# EAGLE design doomba_cape (EAGLE 7.1.0)
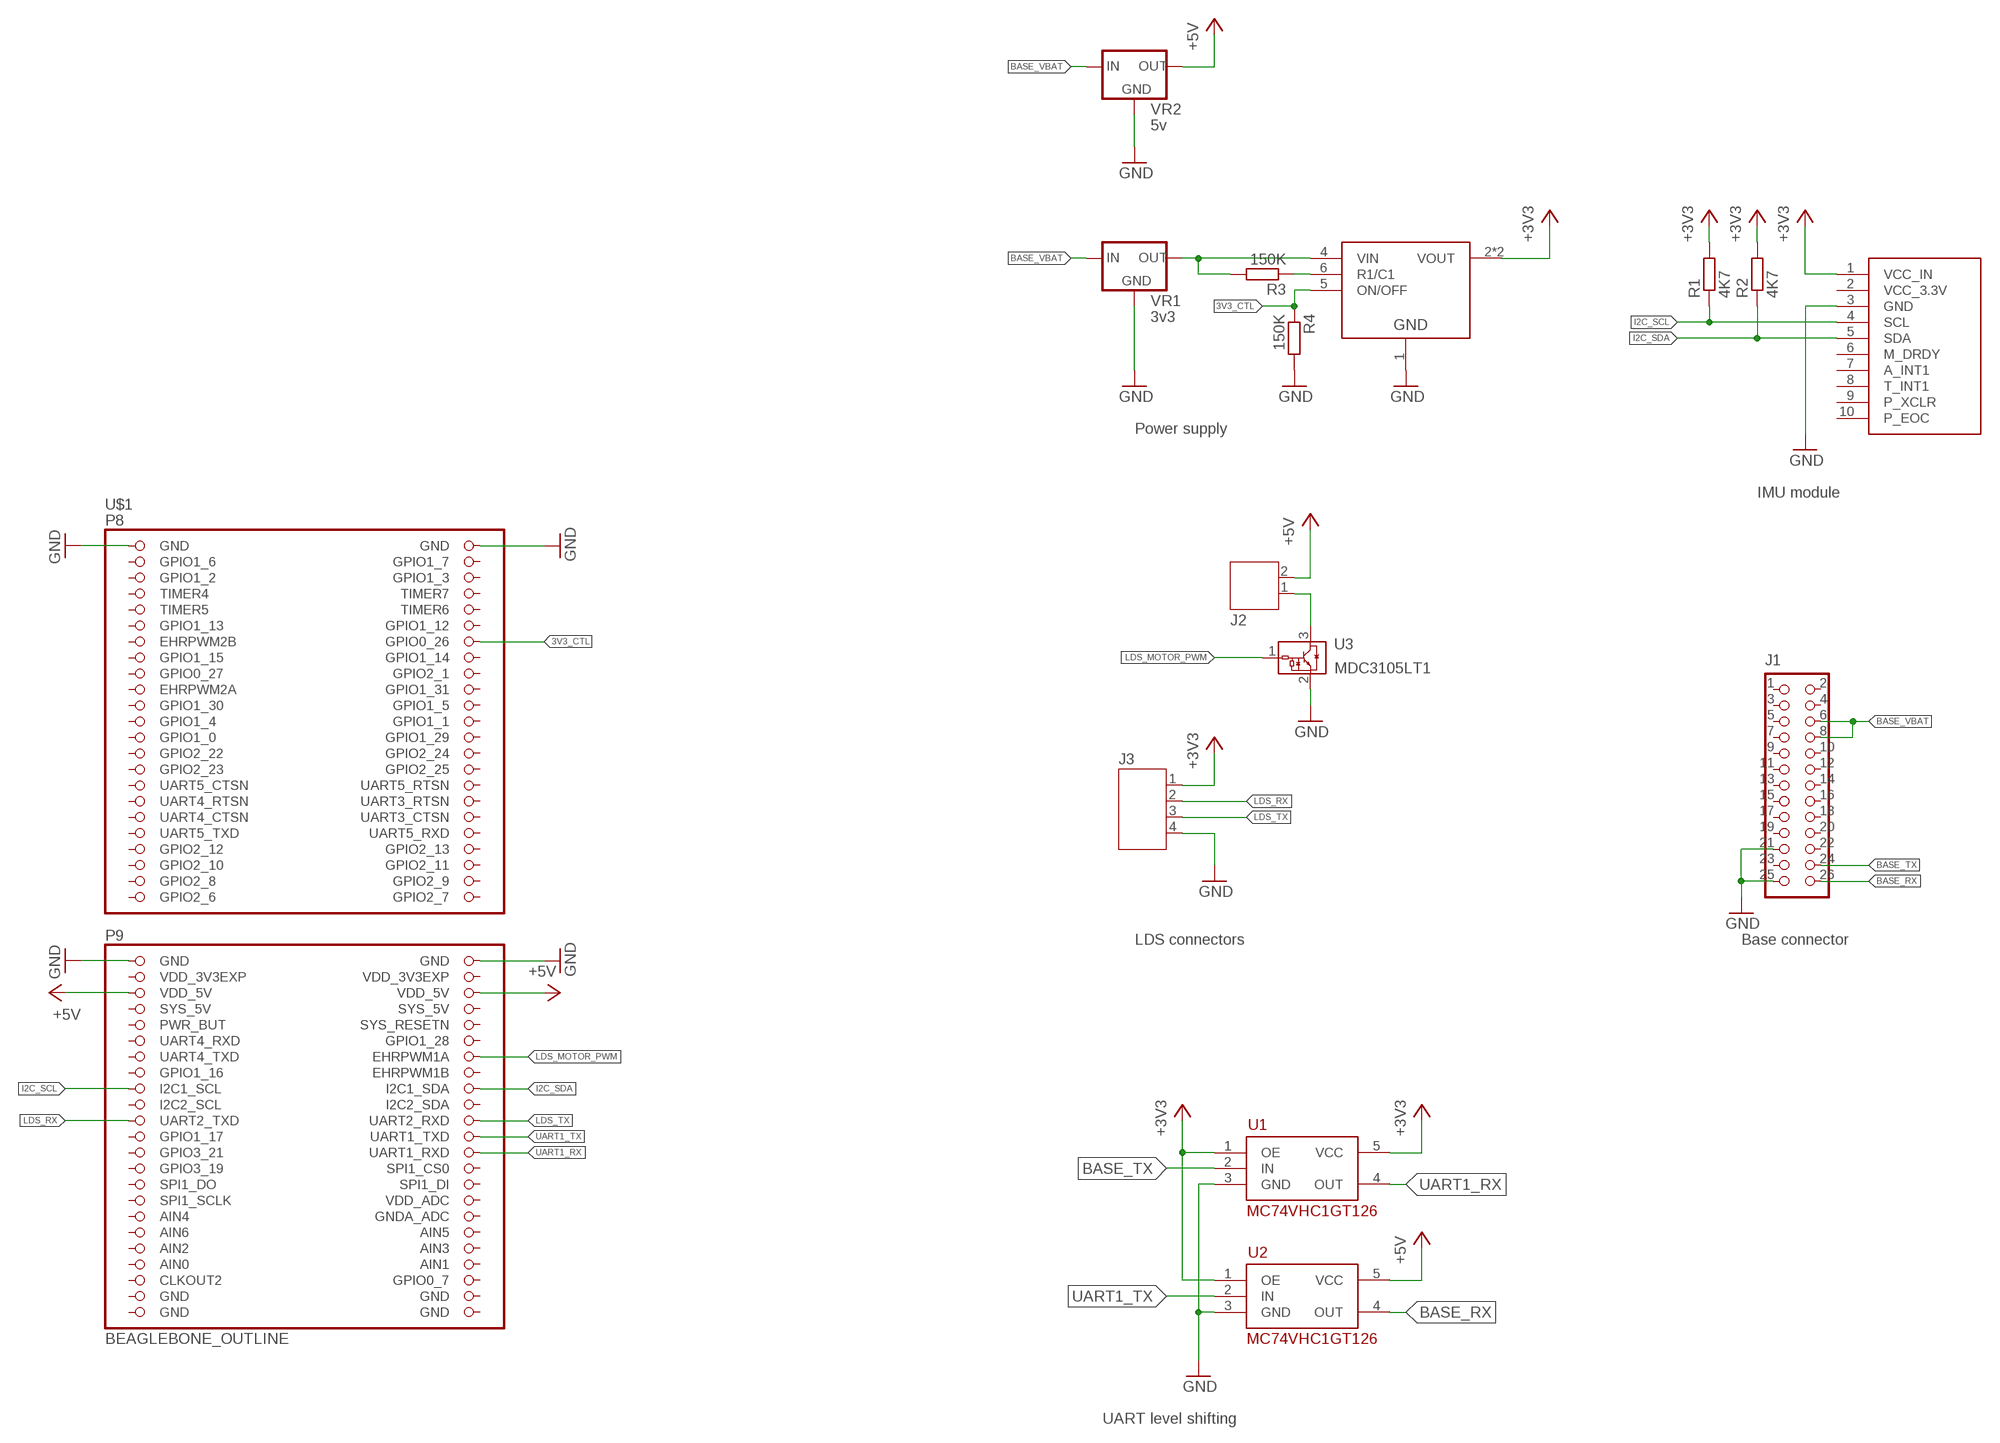
[diagram p0: schematic, sheet 1]

## Parts
J1  CONN_SHROUD_13X2  [SHROUD_13X2]
J2  JST-PH2  [JST-PH2]
J3  JST-PH4  [JST-PH4]
R1  4K7  R-EU_R0603  [R0603]
R2  4K7  R-EU_R0603  [R0603]
R3  150K  R-EU_R0603  [R0603]
R4  150K  R-EU_R0603  [R0603]
U1  MC74VHC1GT126  [SOT-353]
U2  MC74VHC1GT126  [SOT-353]
U3  MDC3105LT1  [SOT23]
U$1  BEAGLEBONE_OUTLINE  [BEAGLEBONE_SHIELD]
U$3  IMU-MODULE  [IMU_MODULE]
U$4  TPS27082L  [DDC]
VR1  3v3  MUR_OKI-78_90DEG  [2X3_90DEG]
VR2  5v  MUR_OKI-78_90DEG  [2X3_90DEG]

## Nets
3V3_CTL: R4.1 U$1.14(GPIO0_26) U$4.5(ON/OFF)
+3V3: J3.1 R1.2 R2.2 U1.1(OE) U1.5(VCC) U2.1(OE) U$3.1(VCC_IN) U$4.2(VOUT) U$4.3(VOUT)
+5V: J2.2 U2.5(VCC) U$1.51(VDD_5V) U$1.52(VDD_5V) VR2.1(OUT)
BASE_RX: J1.26 U2.4(OUT)
BASE_TX: J1.24 U1.2(IN)
BASE_VBAT: J1.6 J1.8 VR1.3(IN) VR2.3(IN)
GND: J1.21 J1.25 J3.4 R4.2 U1.3(GND) U2.3(GND) U3.2(GND) U$1.1(GND) U$1.2(GND) U$1.47(GND) U$1.48(GND) U$3.3(GND) U$4.1(GND) VR1.2(GND) VR2.2(GND)
I2C_SCL: R1.1 U$1.63(I2C1_SCL) U$3.4(SCL)
I2C_SDA: R2.1 U$1.64(I2C1_SDA) U$3.5(SDA)
LDS_MOTOR_PWM: U3.1(VIN) U$1.60(EHRPWM1A)
LDS_RX: J3.2 U$1.67(UART2_TXD)
LDS_TX: J3.3 U$1.68(UART2_RXD)
N$1: R3.2 U$4.4(VIN) VR1.1(OUT)
N$2: R3.1 U$4.6(R1/C1)
N$3: J2.1 U3.3(VOUT)
UART1_RX: U1.4(OUT) U$1.72(UART1_RXD)
UART1_TX: U2.2(IN) U$1.70(UART1_TXD)
Unconnected: J1.1 J1.2 J1.3 J1.4 J1.5 J1.7 J1.9 J1.10 J1.11 J1.12 J1.13 J1.14 J1.15 J1.16 J1.17 J1.18 J1.19 J1.20 J1.22 J1.23 U$1.3(GPIO1_6) U$1.4(GPIO1_7) U$1.5(GPIO1_2) U$1.6(GPIO1_3) U$1.7(TIMER4) U$1.8(TIMER7) U$1.9(TIMER5) U$1.10(TIMER6) U$1.11(GPIO1_13) U$1.12(GPIO1_12) U$1.13(EHRPWM2B) U$1.15(GPIO1_15) U$1.16(GPIO1_14) U$1.17(GPIO0_27) U$1.18(GPIO2_1) U$1.19(EHRPWM2A) U$1.20(GPIO1_31) U$1.21(GPIO1_30) U$1.22(GPIO1_5) U$1.23(GPIO1_4) U$1.24(GPIO1_1) U$1.25(GPIO1_0) U$1.26(GPIO1_29) U$1.27(GPIO2_22) U$1.28(GPIO2_24) U$1.29(GPIO2_23) U$1.30(GPIO2_25) U$1.31(UART5_CTSN) U$1.32(UART5_RTSN) U$1.33(UART4_RTSN) U$1.34(UART3_RTSN) U$1.35(UART4_CTSN) U$1.36(UART3_CTSN) U$1.37(UART5_TXD) U$1.38(UART5_RXD) U$1.39(GPIO2_12) U$1.40(GPIO2_13) U$1.41(GPIO2_10) U$1.42(GPIO2_11) U$1.43(GPIO2_8) U$1.44(GPIO2_9) U$1.45(GPIO2_6) U$1.46(GPIO2_7) U$1.54(SYS_5V) U$1.55(PWR_BUT) U$1.56(SYS_RESETN) U$1.57(UART4_RXD) U$1.58(GPIO1_28) U$1.59(UART4_TXD) U$1.61(GPIO1_16) U$1.62(EHRPWM1B) U$1.65(I2C2_SCL) U$1.66(I2C2_SDA) U$1.69(GPIO1_17) U$1.71(GPIO3_21) U$1.73(GPIO3_19) U$1.74(SPI1_CS0) U$1.75(SPI1_DO) U$1.76(SPI1_DI) U$1.77(SPI1_SCLK) U$1.78(VDD_ADC) U$1.79(AIN4) U$1.80(GNDA_ADC) U$1.81(AIN6) U$1.82(AIN5) U$1.83(AIN2) U$1.84(AIN3) U$1.86(AIN1) U$1.87(CLKOUT2) U$1.88(GPIO0_7) U$3.2(VCC_3.3V) U$3.6(M_DRDY) U$3.7(A_INT1) U$3.8(T_INT1) U$3.9(P_XCLR) U$3.10(P_EOC)

## Notes on the sheet
- Power supply
- IMU module
- LDS connectors | Base connector
- UART level shifting

## Power pins joined to a net without a drawn wire
AIN0: U$1.85(AIN0)
GND: U$1.89(GND) U$1.90(GND) U$1.91(GND) U$1.92(GND)
SYS_5V: U$1.53(SYS_5V)
VDD_3V3EXP: U$1.49(VDD_3V3EXP) U$1.50(VDD_3V3EXP)

## Library data of the parts
J1 = parts:CONN_SHROUD_13X2
J2 = jst-ph:JST-PH2
J3 = jst-ph:JST-PH4
R1-R4 = resistor:R-EU_: RESISTOR, European symbol
U1 U2 = parts:MC74VHC1GT126
U3 = on-semiconductor:MDC3105LT1: Integrated Relay, Inductive Load Driver Sopurce: U6 OnSemi Inductive Load Driver MDC3105-D.PDF; MF: ON SEMICONDUCTOR; MPN: MDC3105LT1; OC_FARNELL: 1126459; OC_NEWARK: 16F6132
U$1 = adafruit:BEAGLEBONE_OUTLINE: Should match A3 pinout - but not completely tested
U$3 = parts:IMU-MODULE
U$4 = parts:TPS27082L: 1.2-8V, 3A PFET load switch
VR1 VR2 = parts:MUR_OKI-78_90DEG: Murata OKI-78 Buck Module mounted in a 90-deg socket

## Board
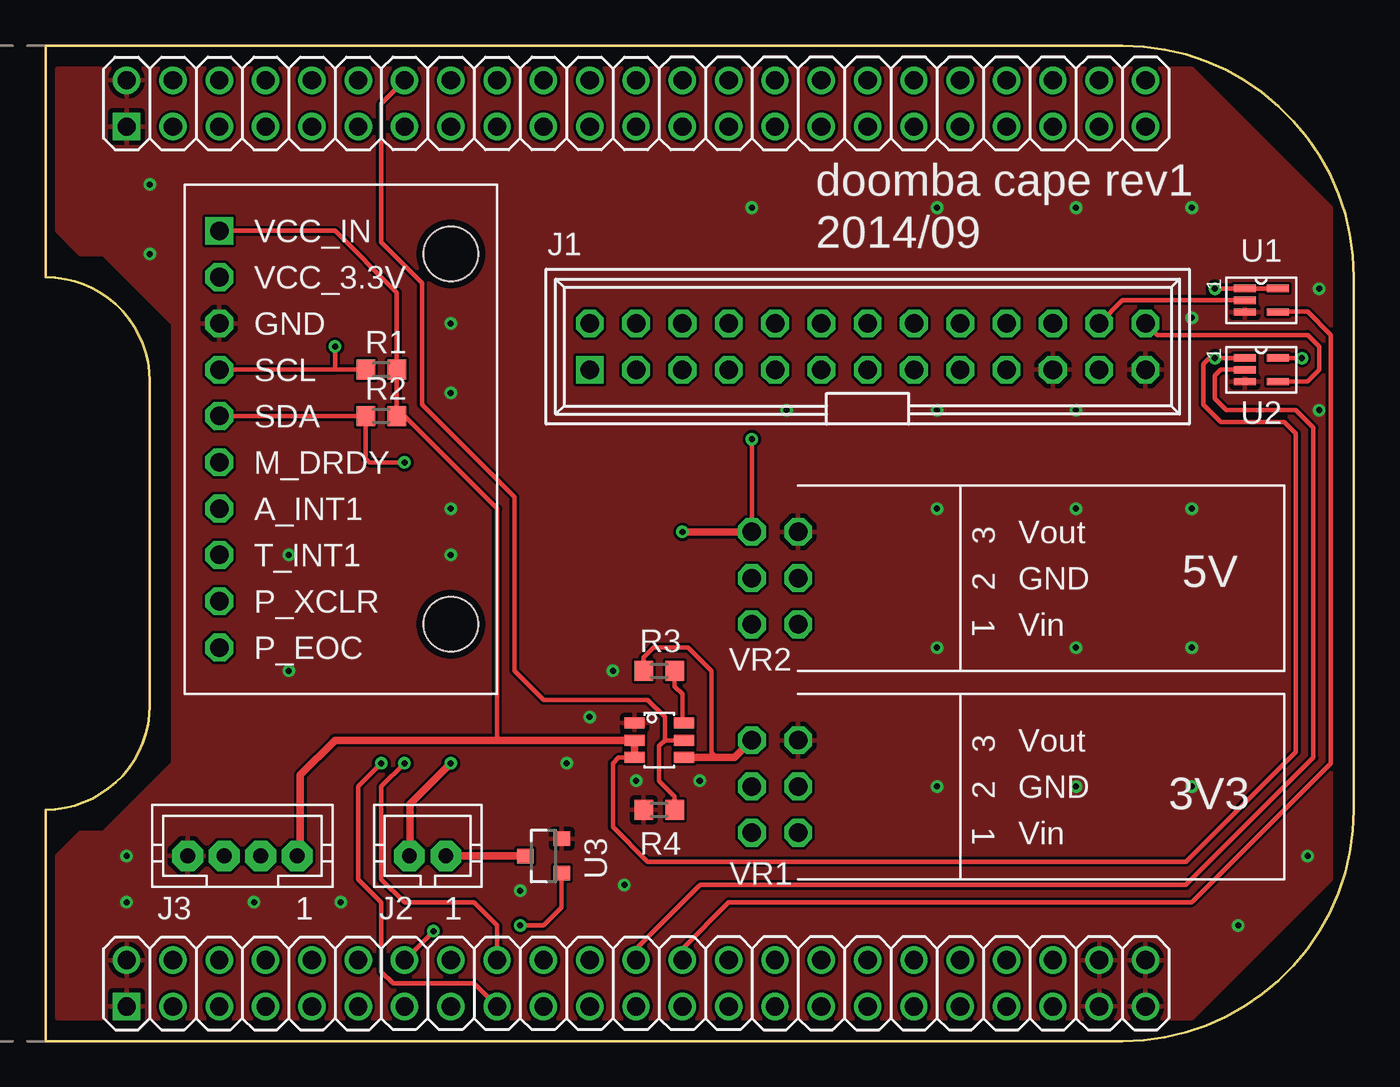
[diagram p1: board, top side]
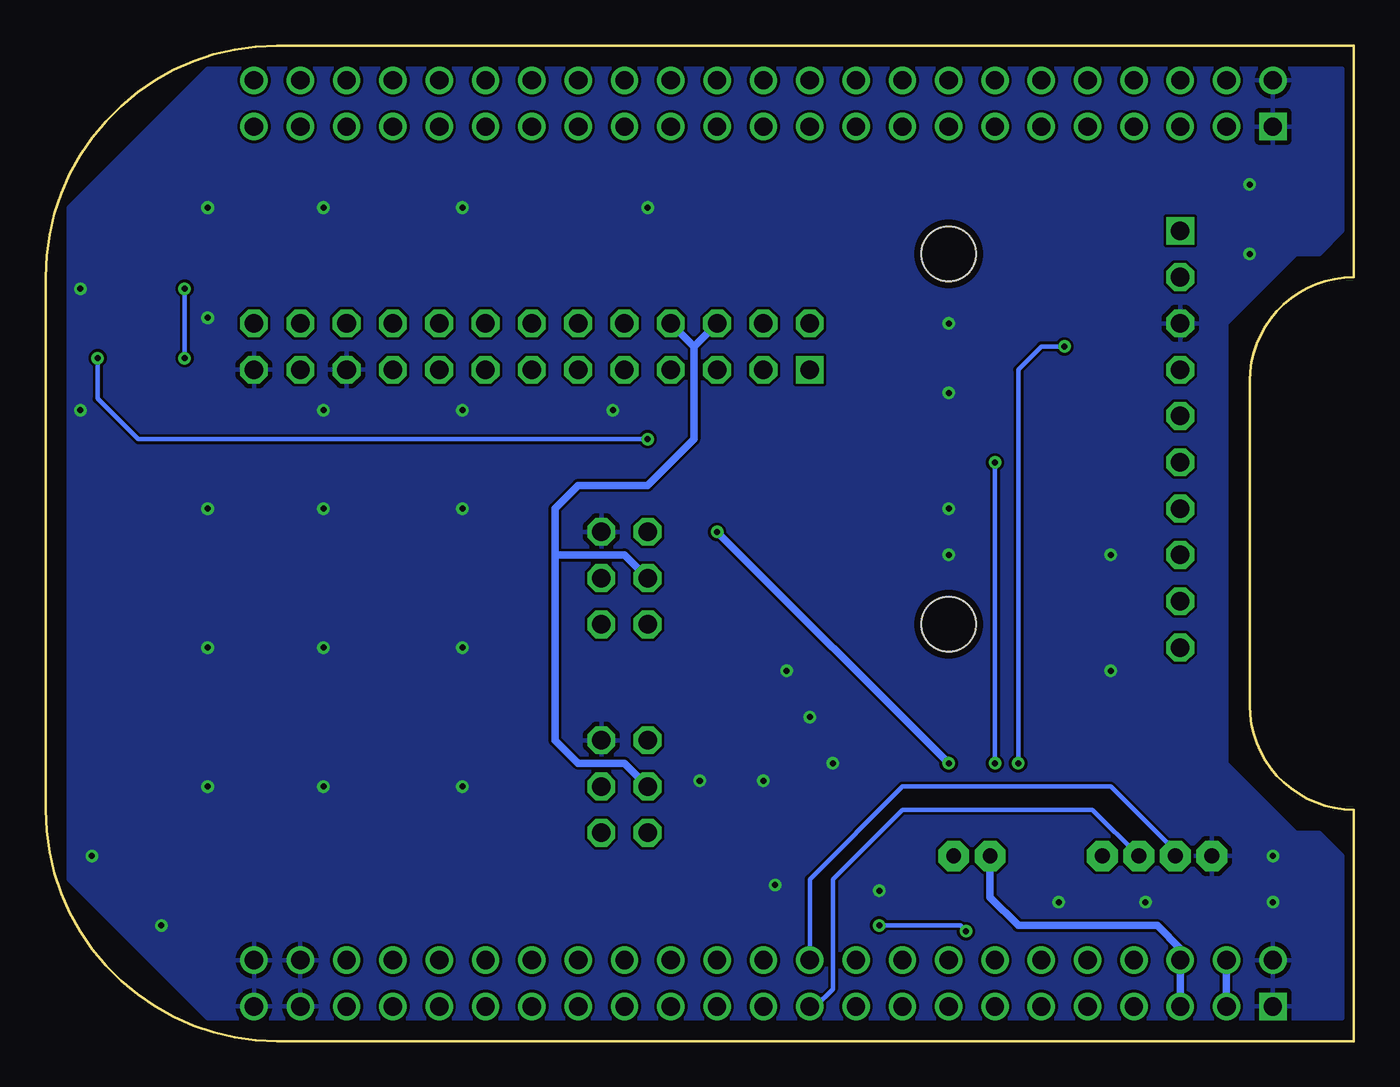
[diagram p2: board, bottom side, seen from below]

Size 71.75 x 54.61 mm. Coordinates in mm from the lower left corner, seen from the top.
Copper layers (1*16): Top 0.0356mm / dielectric 1.5011mm / Bottom 0.0356mm
Design rules "LaenPCBOrder": minimum track width 6mil, minimum drill 13mil, track to track 6mil, track to pad 6mil, pad to pad 6mil, via to via 6mil, smd to smd 6mil, copper to edge 15mil, drill to drill 6mil, minimum pad ring 7mil, minimum via ring 7mil, stop-mask expansion 4mil, vias tented up to drill 0mil, thermal gap 10mil

### Footprints (pad centres in the part's own frame; a part is rotated, then mirrored left to right if it is on the bottom)
SHROUD_13X2 = drill 1.016 square: 1 -15.24,-1.27 | drill 1.016 octagon: 2 -15.24,1.27; 3 -12.7,-1.27; 4 -12.7,1.27; 5 -10.16,-1.27; 6 -10.16,1.27; 7 -7.62,-1.27; 8 -7.62,1.27; 9 -5.08,-1.27; 10 -5.08,1.27; 11 -2.54,-1.27; 12 -2.54,1.27; 13 0,-1.27; 14 0,1.27; 15 2.54,-1.27; 16 2.54,1.27; 17 5.08,-1.27; 18 5.08,1.27; 19 7.62,-1.27; 20 7.62,1.27; 21 10.16,-1.27; 22 10.16,1.27; 23 12.7,-1.27; 24 12.7,1.27; 25 15.24,-1.27; 26 15.24,1.27
JST-PH2 = drill 0.813 pad 1.676 octagon: 1 1,0; 2 -1,0
JST-PH4 = drill 0.813 pad 1.676 octagon: 1 3,0; 2 1,0; 3 -1,0; 4 -3,0
R0603 = smd 1 x 1.1: 1 -0.85,0; 2 0.85,0
SOT-353 = smd 0.4 x 1.2: 1 -0.65,-0.9; 2 0,-0.9; 3 0.65,-0.9; 4 0.65,0.9; 5 -0.65,0.9
SOT23 = smd 0.8 x 0.9: 1 -0.95,-1; 2 0.95,-1; 3 0,1
BEAGLEBONE_SHIELD = drill 1 square: 1 4.445,19.05; 47 52.705,19.05 | drill 1: 2 1.905,19.05; 3 4.445,21.59; 4 1.905,21.59; 5 4.445,24.13; 6 1.905,24.13; 7 4.445,26.67; 8 1.905,26.67; 9 4.445,29.21; 10 1.905,29.21; 11 4.445,31.75; 12 1.905,31.75; 13 4.445,34.29; 14 1.905,34.29; 15 4.445,36.83; 16 1.905,36.83; 17 4.445,39.37; 18 1.905,39.37; 19 4.445,41.91; 20 1.905,41.91; 21 4.445,44.45; 22 1.905,44.45; 23 4.445,46.99; 24 1.905,46.99; 25 4.445,49.53; 26 1.905,49.53; 27 4.445,52.07; 28 1.905,52.07; 29 4.445,54.61; 30 1.905,54.61; 31 4.445,57.15; 32 1.905,57.15; 33 4.445,59.69; 34 1.905,59.69; 35 4.445,62.23; 36 1.905,62.23; 37 4.445,64.77; 38 1.905,64.77; 39 4.445,67.31; 40 1.905,67.31; 41 4.445,69.85; 42 1.905,69.85; 43 4.445,72.39; 44 1.905,72.39; 45 4.445,74.93; 46 1.905,74.93; 48 50.165,19.05; 49 52.705,21.59; 50 50.165,21.59; 51 52.705,24.13; 52 50.165,24.13; 53 52.705,26.67; 54 50.165,26.67; 55 52.705,29.21; 56 50.165,29.21; 57 52.705,31.75; 58 50.165,31.75; 59 52.705,34.29; 60 50.165,34.29; 61 52.705,36.83; 62 50.165,36.83; 63 52.705,39.37; 64 50.165,39.37; 65 52.705,41.91; 66 50.165,41.91; 67 52.705,44.45; 68 50.165,44.45; 69 52.705,46.99; 70 50.165,46.99; 71 52.705,49.53; 72 50.165,49.53; 73 52.705,52.07; 74 50.165,52.07; 75 52.705,54.61; 76 50.165,54.61; 77 52.705,57.15; 78 50.165,57.15; 79 52.705,59.69; 80 50.165,59.69; 81 52.705,62.23; 82 50.165,62.23; 83 52.705,64.77; 84 50.165,64.77; 85 52.705,67.31; 86 50.165,67.31; 87 52.705,69.85; 88 50.165,69.85; 89 52.705,72.39; 90 50.165,72.39; 91 52.705,74.93; 92 50.165,74.93
IMU_MODULE = drill 1.016 square: 1 0,11.43 | drill 1.016 octagon: 2 0,8.89; 3 0,6.35; 4 0,3.81; 5 0,1.27; 6 0,-1.27; 7 0,-3.81; 8 0,-6.35; 9 0,-8.89; 10 0,-11.43 | hole 2.997: 12.7,10.16; 12.7,-10.16
DDC = smd 0.6 x 1.1: 1 -0.95,-1.35; 2 0,-1.35; 3 0.95,-1.35; 4 0.95,1.35; 5 0,1.35; 6 -0.95,1.35
2X3_90DEG = drill 1.016 octagon: 1 -2.54,-1.27; 2 -2.54,1.27; 3 0,-1.27; 4 0,1.27; 5 2.54,-1.27; 6 2.54,1.27

### Placement (x,y rotation side)
J1  45.09,38.1 0 top
J2  20.95,10.16 0 top
J3  10.79,10.16 0 top
R1  18.41,36.83 0 top
R2  18.41,34.29 0 top
R3  33.66,20.32 180 top
R4  33.66,12.7 180 top
U1  66.67,40.64 270 top
U2  66.67,36.83 270 top
U3  27.3,10.16 90 top
U$1  -14.61,54.61 270 top
U$3  9.53,33.02 0 top
U$4  33.66,16.51 270 top
VR1  40.01,13.97 270 top
VR2  40.01,25.4 270 top

### Tracks (layer width: path | path; a pad name or v marks a point on that pad's centre or on a via)
3V3_CTL
  Top 0.254: R4.1 34.51,13.44 33.66,14.29 33.66,16.19 33.97,16.51 | 33.97,16.51 U$4.5 | 33.97,16.51 33.97,17.78 33.02,18.73 27.3,18.73 25.72,20.32 25.72,29.84 20.64,34.92 20.64,41.59 18.41,43.81 18.41,51.44 U$1.14
+3V3  (via drill 0.33)
  Top 0.254: U1.5 U1.1 64.13,41.29 v64.13,41.27 | U2.1 64.15,37.48 v64.13,37.47 63.82,37.47 63.5,37.15 63.5,34.92 64.45,33.97 67.94,33.97 68.58,33.34 68.58,15.88 62.55,9.84 33.02,9.84 31.12,11.75 31.12,15.24 31.43,15.56 U$4.3 | U$3.1 15.88,44.45 19.27,41.06 R1.2 R2.2 19.69,34.29 24.77,29.21 24.77,16.51
  Top 0.406: U$4.3 U$4.2 24.77,16.51 15.88,16.51 13.97,14.61 13.97,10.34 J3.1
  Bottom 0.254: v64.13,41.27 v64.13,37.47
+5V  (via drill 0.33)
  Top 0.254: U2.5 68.88,37.48 v68.9,37.47 | v38.73,33.02 VR2.1
  Top 0.406: J2.2 20,10.21 20,13.02 v22.23,15.24 | v34.93,27.94 VR2.1
  Bottom 0.254: v68.9,37.47 68.9,35.24 66.67,33.02 v38.73,33.02
  Bottom 0.406: U$1.51 U$1.52 9.53,5.08 10.79,6.35 18.41,6.35 19.95,7.89 J2.2 | v22.23,15.24 v34.93,27.94
BASE_RX
  Top 0.254: J1.26 60.96,38.73 69.21,38.73 69.85,38.1 69.85,36.83 69.2,36.18 U2.4
BASE_TX
  Top 0.254: U1.2 59.05,40.64 J1.24
BASE_VBAT
  Bottom 0.406: J1.6 36.2,38.1 | 36.2,38.1 36.2,33.02 38.73,30.48 42.55,30.48 43.82,29.21 43.82,26.67 | 43.82,26.67 40.01,26.67 VR2.3 | VR1.3 40.01,15.24 42.55,15.24 43.82,16.51 43.82,26.67 | J1.8 36.2,38.1
GND  (via drill 0.33)
  other vias: 69.21,10.16 65.41,6.35 62.87,21.59 62.87,13.97 56.52,13.97 69.85,34.61 69.85,41.27 62.87,45.72 56.52,45.72 48.9,45.72 38.73,45.72 48.9,29.21 56.52,29.21 62.87,29.21 56.52,21.59 48.9,21.59 48.9,13.97 31.75,8.57 28.58,15.24 26.04,8.26 16.19,7.62 11.43,7.62 4.45,7.62 4.45,10.16 22.23,26.67 13.34,20.32 22.23,29.21 22.23,35.56 22.23,39.37 5.71,43.18 5.71,46.99 40.64,34.61 48.9,34.61 56.52,34.61 13.34,26.67 62.87,39.69 32.39,14.29 35.88,14.29 29.84,17.78 31.12,20.32
  pour Top: 0.64,53.34 0.64,44.45 1.91,43.18 3.18,43.18 6.99,39.37 6.99,15.24 3.18,11.43 1.91,11.43 0.64,10.16 0.64,1.27 61.59,1.27 62.87,1.27 65.41,3.81 70.48,8.89 70.48,45.72 62.87,53.34
  pour Bottom: 0.64,53.34 0.64,44.45 1.91,43.18 3.18,43.18 6.99,39.37 6.99,15.24 3.18,11.43 1.91,11.43 0.64,10.16 0.64,1.27 62.87,1.27 70.48,8.89 70.48,45.72 62.87,53.34
I2C_SCL  (via drill 0.33)
  Top 0.254: U$3.4 15.88,36.83 | R1.1 15.88,36.83 | 15.88,36.83 v15.88,38.1 | v18.41,15.24 17.15,13.97 17.15,8.89 18.41,7.62 18.41,3.81 19.05,3.17 23.49,3.17 U$1.63
  Bottom 0.254: v15.88,38.1 17.15,38.1 18.41,36.83 v18.41,15.24
I2C_SDA  (via drill 0.33)
  Top 0.254: U$3.5 R2.1 17.56,31.96 17.78,31.75 v19.69,31.75 | v19.69,15.24 18.41,13.97 18.41,8.89 19.69,7.62 23.49,7.62 24.77,6.35 U$1.64
  Bottom 0.254: v19.69,31.75 v19.69,15.24
LDS_MOTOR_PWM  (via drill 0.33)
  Top 0.254: U$1.60 v21.27,6.03 | v26.04,6.35 27.3,6.35 28.3,7.35 U3.1
  Bottom 0.254: v21.27,6.03 21.59,6.35 v26.04,6.35
LDS_RX
  Bottom 0.254: J3.2 14.34,12.7 24.77,12.7 28.58,8.89 28.58,2.86 29.53,1.91 U$1.67
LDS_TX
  Bottom 0.254: U$1.68 29.84,8.89 24.77,13.97 13.34,13.97 9.79,10.43 J3.3
N$1
  Top 0.254: R3.2 32.8,21.06 33.34,21.59 35.24,21.59 36.51,20.32 36.51,15.83 36.79,15.56
  Top 0.406: U$4.4 36.79,15.56 37.79,15.56 VR1.1
N$2
  Top 0.254: R3.1 34.51,19.47 34.93,19.05 34.93,17.54 U$4.6
N$3
  Top 0.406: J2.1 U3.3
UART1_RX
  Top 0.254: U$1.72 34.93,5.08 37.47,7.62 62.87,7.62 70.48,15.24 70.48,38.73 69.21,40.01 67.59,40.01 U1.4
UART1_TX
  Top 0.254: U$1.70 32.39,5.08 35.88,8.57 62.55,8.57 69.53,15.56 69.53,33.66 68.58,34.61 64.77,34.61 64.13,35.24 64.13,36.51 64.45,36.83 U2.2
VDD_3V3EXP
  Bottom 0.406: U$1.49 U$1.50

### Text on the board
tPlace: doomba cape rev1 | 2014/09 | 5V | 3V3